# EasyEDA Pro project plotter-esp.epro

# Schematic Schematic1
Board Name: Board1; Create Date: 2026-03-18; Page Name: P1; Project Name: New Project_2026-03-18_12-49-19; Schematic Name: Schematic1; Update Date: 2026-03-18; Company: EasyEDA.com; Page Size: A4; Version: V1.0
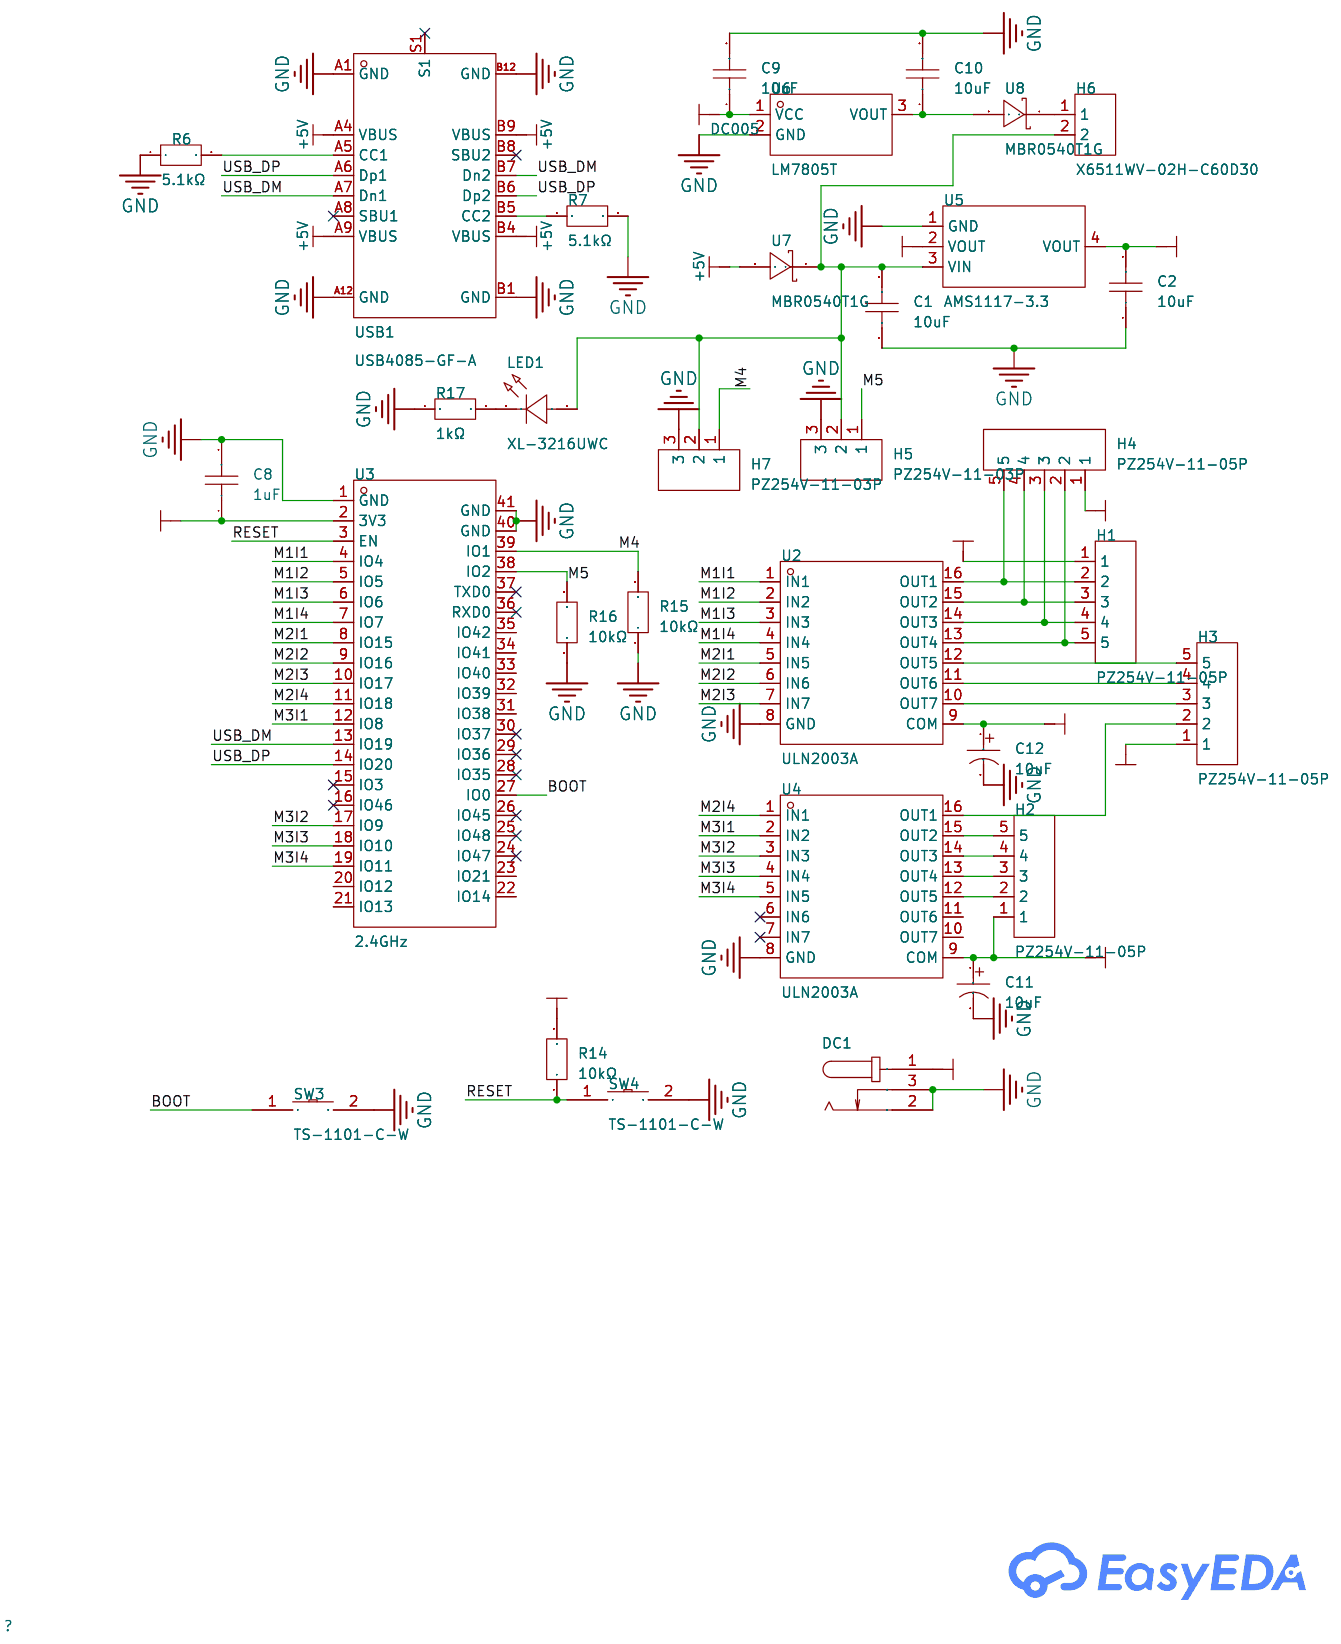
[diagram p0: schematic sheet]

## Parts
C1  10uF  [C1206]
C2  10uF  [C1206]
C8  1uF  [C1206]
C9  10uF  [C1206]
C10  10uF  [C1206]
C11  10uF  [CAP-TH_BD4.0-P1.50-D0.8-FD]
C12  10uF  [CAP-TH_BD4.0-P1.50-D0.8-FD]
DC1  DC005  [DC-IN-TH_DC005]
H1  PZ254V-11-05P  [HDR-TH_5P-P2.54-V-M]
H2  PZ254V-11-05P  [HDR-TH_5P-P2.54-V-M]
H3  PZ254V-11-05P  [HDR-TH_5P-P2.54-V-M]
H4  PZ254V-11-05P  [HDR-TH_5P-P2.54-V-M]
H5  PZ254V-11-03P  [HDR-TH_3P-P2.54-V-M_PZ254V-11-03P]
H6  X6511WV-02H-C60D30  [HDR-TH_2P-P2.54-V-M]
H7  PZ254V-11-03P  [HDR-TH_3P-P2.54-V-M_PZ254V-11-03P]
LED1  XL-3216UWC  [LED1206-R-RD_WHITE]
R6  5.1kΩ  [R1206]
R7  5.1kΩ  [R1206]
R14  10kΩ  [R1206]
R15  10kΩ  [R1206]
R16  10kΩ  [R1206]
R17  1kΩ  [R1206]
SW3  TS-1101-C-W  [SW-SMD_L6.0-W3.3-LS8.0]
SW4  TS-1101-C-W  [SW-SMD_L6.0-W3.3-LS8.0]
U2  ULN2003A  [DIP-16_L20.0-W6.4-P2.54-LS7.6-BL]
U3  2.4GHz  [WIRELM-SMD_ESP32-S3-WROOM-1U]
U4  ULN2003A  [DIP-16_L20.0-W6.4-P2.54-LS7.6-BL]
U5  AMS1117-3.3  [SOT-223-3_L6.5-W3.4-P2.30-LS7.0-BR]
U6  LM7805T  [TO-220-3_L10.1-W4.7-P2.54-L]
U7  MBR0540T1G  [SOD-123_L2.8-W1.8-LS3.7-RD]
U8  MBR0540T1G  [SOD-123_L2.8-W1.8-LS3.7-RD]
USB1  USB4085-GF-A  [USC-C-SMD_USB4085-GF-A]

## Library data of the parts
C1 C2 C9 C10 = CL31A106KAHNNNE: Capacitance:10uF Tolerance:±10% Tolerance:±10% Voltage Rating:25V Temperature Coefficient:X5R; LCSC Part Name: 10uF ±10% 25V; Supplier Part: C9807; Manufacturer: SAMSUNG(三星); Supplier Footprint: 1206; JLCPCB Part Class: Extended Part; Datasheet: https://item.szlcsc.com/datasheet/CL31A106KAHNNNE/10337.html; Supplier: LCSC; Tolerance: ±10%; Voltage Rating: 25V; Temperature Coefficient: X5R
C8 = CL31B105KBHNNNE: Capacitance:1uF Tolerance:±10% Tolerance:±10% Voltage Rating:50V Temperature Coefficient:X7R; LCSC Part Name: 1uF ±10% 50V; Supplier Part: C1848; Manufacturer: SAMSUNG(三星); Supplier Footprint: 1206; JLCPCB Part Class: Basic Part; Datasheet: https://item.szlcsc.com/datasheet/CL31B105KBHNNNE/2200.html; Supplier: LCSC; Tolerance: ±10%; Voltage Rating: 50V; Temperature Coefficient: X7R
C11 C12 = KF106M025C05RR0VH2FP0: Capacitance:10uF Tolerance:±20% Tolerance:±20% Voltage Rating:25V Ripple Current:20mA@120Hz Equivalent Series Resistance(ESR):- Pin Spacing:1.5mm Diameter:4mm Height - Seated (Max):5mm Lifetime:1000hrs@105℃ Operating Temperature:-40℃~+105℃ Operating Tempe; LCSC Part Name: 10uF ±20% 25V; Supplier Part: C43846; Manufacturer: Chengx(承兴); Supplier Footprint: 插件,D4xL5mm; JLCPCB Part Class: Extended Part; Datasheet: https://item.szlcsc.com/datasheet/KF106M025C05RR0VH2FP0/44848.html; Supplier: LCSC; Tolerance: ±20%; Voltage Rating: 25V; Ripple Current: 20mA@120Hz; Pin Spacing: 1.5mm; Diameter: 4mm; Height - Seated (Max): 5mm; Lifetime: 1000hrs@105℃; Operating Temperature: -40℃~+105℃
DC1 = DC005: Connector Type:DC Power Jack Mounting Type:Right Angle Inside Contact Diameter:2mm Outside Contact Diameter:6.3mm Current Rating:500mA Voltage Rating (Max):12V Operating Temperature:-30℃~+70℃ Operating Temperature:-30℃~+70℃; LCSC Part Name: DC005-2.0 黑（铁）; Supplier Part: C431533; Manufacturer: SHOU HAN(首韩); Supplier Footprint: 插件; JLCPCB Part Class: Extended Part; Datasheet: https://item.szlcsc.com/datasheet/DC005/427890.html; Supplier: LCSC; Connector Type: DC Power Jack; Mounting Type: Right Angle; Inside Contact Diameter: 2mm; Outside Contact Diameter: 6.3mm; Current Rating: 500mA; Voltage Rating (Max): 12V; Operating Temperature: -30℃~+70℃
H1-H4 = PZ254V-11-05P: Pin Structure:1x5P Pitch:2.54mm Row Spacing:- Circluar Pins/Square Pins:Pin Header Mounting Type:Through Hole Number of Rows:1 Number of Pins:5P Current Rating:3A Voltage Rating (Max):250V Length of Mating Pin:6mm Insulation Height:2.5mm Length of End Con; LCSC Part Name: 1x5P 间距:2.54mm 方针 直插; Supplier Part: C492404; Manufacturer: XFCN(兴飞); Supplier Footprint: 插件,P=2.54mm; JLCPCB Part Class: Extended Part; Datasheet: https://item.szlcsc.com/datasheet/PZ254V-11-05P/502960.html; Supplier: LCSC; Pin Structure: 1x5P; Pitch: 2.54mm; Circluar Pins/Square Pins: Pin Header; Mounting Type: Through Hole; Number of Rows: 1; Number of Pins: 5P; Current Rating: 3A; Voltage Rating (Max): 250V; Length of Mating Pin: 6mm; Insulation Height: 2.5mm; Length of End Connection Pin: 3mm; Contact Material: Brass; Operating Temperature: -40℃~+105℃; Color: Black
H5 H7 = PZ254V-11-03P: Pin Structure:1x3P Pitch:2.54mm Row Spacing:- Circluar Pins/Square Pins:Pin Header Mounting Type:Through Hole Number of Rows:1 Number of Pins:3P Current Rating:3A Voltage Rating (Max):250V Length of Mating Pin:6mm Insulation Height:2.5mm Length of End Con; LCSC Part Name: 1x3P 间距:2.54mm 方针 直插; Supplier Part: C2937625; Manufacturer: XFCN(兴飞); Supplier Footprint: 插件,P=2.54mm; JLCPCB Part Class: Extended Part; Datasheet: https://item.szlcsc.com/datasheet/PZ254V-11-03P/3293280.html; Supplier: LCSC; Pin Structure: 1x3P; Pitch: 2.54mm; Circluar Pins/Square Pins: Pin Header; Mounting Type: Through Hole; Number of Rows: 1; Number of Pins: 3P; Current Rating: 3A; Voltage Rating (Max): 250V; Length of Mating Pin: 6mm; Insulation Height: 2.5mm; Length of End Connection Pin: 3mm; Operating Temperature: -40℃~+105℃; Color: Black
H6 = X6511WV-02H-C60D30: Pin Structure:1x2P Pitch:2.54mm Row Spacing:2.54mm Circluar Pins/Square Pins:Pin Header Number of Rows:1 Number of Pins:2P Current Rating:3A Voltage Rating (Max):250V Length of Mating Pin:- Insulation Height:2.5mm Length of End Connection Pin:- Contact Ma; LCSC Part Name: 1x2P 间距:2.54mm 方针; Supplier Part: C706874; Manufacturer: XKB Connection(中国星坤); Supplier Footprint: 插件,P=2.54mm; JLCPCB Part Class: Extended Part; Datasheet: https://item.szlcsc.com/datasheet/X6511WV-02H-C60D30/743996.html; Supplier: LCSC; Pin Structure: 1x2P; Pitch: 2.54mm; Row Spacing: 2.54mm; Circluar Pins/Square Pins: Pin Header; Number of Rows: 1; Number of Pins: 2P; Current Rating: 3A; Voltage Rating (Max): 250V; Insulation Height: 2.5mm; Contact Material: Brass; Contact Plating: Gold; Operating Temperature: -40℃~+105℃; Color: Black
LED1 = XL-3216UWC: Lamp Holder Type:- Illumination Color:White Voltage - Forward(Vf):3.4V Voltage - Forward(Vf):3.4V Power(Watts):70mW Forward Current:20mA Wavelength - Dominant:- Wavelength - Dominant:- Peak Wavelength:- Diode Configuration:- Lens Color:Yellow Lens Color T; LCSC Part Name: 1206白光贴片式发光二极管; Supplier Part: C965828; Manufacturer: XINGLIGHT(成兴光); Supplier Footprint: 1206; JLCPCB Part Class: Extended Part; Datasheet: https://item.szlcsc.com/datasheet/XL-3216UWC/1051437.html; Supplier: LCSC; Illumination Color: White; Voltage - Forward(Vf): 3.4V; Power(Watts): 70mW; Forward Current: 20mA; Lens Color: Yellow Lens; Color Temperature: 12000K~27000K; Luminous Intensity: 1300mcd; Viewing Angle: 120°; Mounting Style: op View Mount; Operating Temperature: -40℃~+85℃
R6 R7 = FRC1206J512 TS: Type:Thick Film Resistor Resistance:5.1kΩ Tolerance:±5% Tolerance:±5% Power(Watts):250mW Voltage-Supply(Max):200V Temperature Coefficient:±100ppm/℃ Temperature Coefficient:±100ppm/℃ Operating Temperature:-55℃~+155℃ Operating Temperature:-55℃~+155℃; LCSC Part Name: 5.1kΩ ±5% 250mW 厚膜电阻; Supplier Part: C2907509; Manufacturer: FOJAN(富捷); Supplier Footprint: 1206; JLCPCB Part Class: Extended Part; Supplier: LCSC; Type: Thick Film Resistor; Tolerance: ±5%; Power(Watts): 250mW; Voltage-Supply(Max): 200V; Temperature Coefficient: ±100ppm/℃; Operating Temperature: -55℃~+155℃
R14-R16 = FRC1206J103 TS: Type:Thick Film Resistor Resistance:10kΩ Tolerance:±5% Tolerance:±5% Power(Watts):250mW Voltage-Supply(Max):200V Temperature Coefficient:±100ppm/℃ Temperature Coefficient:±100ppm/℃ Operating Temperature:-55℃~+155℃ Operating Temperature:-55℃~+155℃; LCSC Part Name: 10kΩ ±5% 250mW 厚膜电阻; Supplier Part: C2907423; Manufacturer: FOJAN(富捷); Supplier Footprint: 1206; JLCPCB Part Class: Extended Part; Supplier: LCSC; Type: Thick Film Resistor; Tolerance: ±5%; Power(Watts): 250mW; Voltage-Supply(Max): 200V; Temperature Coefficient: ±100ppm/℃; Operating Temperature: -55℃~+155℃
R17 = FRC1206J102 TS: Type:Thick Film Resistor Resistance:1kΩ Tolerance:±5% Tolerance:±5% Power(Watts):250mW Voltage-Supply(Max):200V Temperature Coefficient:±100ppm/℃ Temperature Coefficient:±100ppm/℃ Operating Temperature:-55℃~+155℃ Operating Temperature:-55℃~+155℃; LCSC Part Name: 1kΩ ±5% 250mW 厚膜电阻; Supplier Part: C2907440; Manufacturer: FOJAN(富捷); Supplier Footprint: 1206; JLCPCB Part Class: Extended Part; Supplier: LCSC; Type: Thick Film Resistor; Tolerance: ±5%; Power(Watts): 250mW; Voltage-Supply(Max): 200V; Temperature Coefficient: ±100ppm/℃; Operating Temperature: -55℃~+155℃
SW3 SW4 = TS-1101-C-W: Circuit:SPST Actuator Style:Rectangle button Operating Force:260gf Mounting Style:Brick nogging Switch Length:6mm Switch Width:3.6mm Switch Height:2.5mm Strike Gundam:不带 Contact Current:50mA Voltage Rating (AC):- Voltage Rating (DC):12V Power Rating:- Ins; LCSC Part Name: 6*3.6*2.5mm 立贴 轻触开关; Supplier Part: C318938; Manufacturer: XKB Connectivity(中国星坤); Supplier Footprint: SMD; JLCPCB Part Class: Extended Part; Datasheet: https://atta.szlcsc.com/upload/public/pdf/source/20200227/C318938_C2E53B1EEDE37D980A33616AC086DE53.pdf; Supplier: LCSC; Circuit: SPST; Actuator Style: Rectangle button; Operating Force: 260gf; Mounting Style: Brick nogging; Switch Length: 6mm; Switch Width: 3.6mm; Switch Height: 2.5mm; Strike Gundam: 不带; Contact Current: 50mA; Voltage Rating (DC): 12V; Actuator/Cap Color: 白色带淡绿; With Lamp: No; Mechanical Life: 5万次; Operating Temperature: -30℃~+85℃
U2 U4 = ULN2003A_C93000: number of channels:7 Collector - Emitter Voltage VCEO:50V Current - Collector(Ic):500mA Voltage - Input(Max):30V Operating Temperature:-40℃~+85℃ Operating Temperature:-40℃~+85℃ Output Leakage Current(Icex):50uA Input Current(on):0.82mA Input Current(off):; LCSC Part Name: 七达林顿阵列; Supplier Part: C93000; Manufacturer: ST(意法半导体); Supplier Footprint: DIP-16; JLCPCB Part Class: Extended Part; Datasheet: https://item.szlcsc.com/datasheet/ULN2003A/94195.html; Supplier: LCSC; number of channels: 7; Collector - Emitter Voltage VCEO: 50V; Current - Collector(Ic): 500mA; Voltage - Input(Max): 30V; Operating Temperature: -40℃~+85℃; Output Leakage Current(Icex): 50uA; Input Current(on): 0.82mA; Input Current(off): 65uA; Voltage - Forward(Vf): 1.7V; Input Capacitiance(Ci): 15pF
U3 = ESP32-S3-WROOM-1U-N4R8: Utilized IC / Part:ESP32-S3R8 Wireless Standard:Bluetooth5.0 Interface Type:I2C；GPIO；UART；SPI；SDIO；USB；I2S Frequency:2.4GHz Output Power:20.5dBm Output Power:20.5dBm Voltage - Supply:3V~3.6V Voltage - Supply:3V~3.6V Receive  Current:95mA Send  Current:355; LCSC Part Name: 不带固件 通用型Wi-Fi+低功耗蓝牙MCU模组; Supplier Part: C3013943; Manufacturer: ESPRESSIF(乐鑫); Supplier Footprint: SMD,19.2x18mm; JLCPCB Part Class: Extended Part; Datasheet: https://item.szlcsc.com/datasheet/ESP32-S3-WROOM-1U-N4R8/3522413.html; Supplier: LCSC; Utilized IC / Part: ESP32-S3R8; Wireless Standard: Bluetooth5.0; Interface Type: I2C；GPIO；UART；SPI；SDIO；USB；I2S; Output Power: 20.5dBm; Voltage - Supply: 3V~3.6V; Receive  Current: 95mA; Send  Current: 355mA; Sensitivity: -103.5dBm; Operating Temperature: -40℃~+65℃
U5 = AMS1117-3.3_C6186: Output Type:Fixed Voltage - Supply:15V Output Voltage:3.3V Output Voltage:3.3V Output Current:1A Power Supply Rejection Ratio (PSRR):72dB@(120Hz) Voltage Dropout:1.1V@(800mA) standby current:5mA Noise:0.003%Vout Features:Over Current Protection；Thermal Sh; LCSC Part Name: 3.3V 1A 15V; Supplier Part: C6186; Manufacturer: AMS; Supplier Footprint: SOT-223; JLCPCB Part Class: Basic Part; Datasheet: https://item.szlcsc.com/datasheet/AMS1117-3.3/6652.html; Supplier: LCSC; Output Type: Fixed; Voltage - Supply: 15V; Output Voltage: 3.3V; Output Current: 1A; Power Supply Rejection Ratio (PSRR): 72dB@(120Hz); Voltage Dropout: 1.1V@(800mA); standby current: 5mA; Noise: 0.003%Vout; Features: Over Current Protection；Thermal Shutdown; Operating Temperature: -40℃~+125℃; Output Configuration: Positive; Number of Outputs: 1
U6 = LM7805T_C7432180: Supplier Part: C7432180; Manufacturer: HGSEMI(华冠); Supplier Footprint: TO-220-3; JLCPCB Part Class: Extended Part; Datasheet: https://atta.szlcsc.com/upload/public/pdf/source/20240307/E28367F2CC2BC825DF756EF02CE1AF99.pdf; Supplier: LCSC
U7 U8 = MBR0540T1G_C20611940: Diode Configuration:Independent Voltage - Forward(Vf@If):550mV@500mA Voltage - DC Reverse(Vr):40V Current - Rectified:500mA Reverse Leakage Current (Ir):- Operating Junction Temperature Range:-40℃~+125℃ Operating Junction Temperature Range:-40℃~+125℃ Non-; LCSC Part Name: 电压:40V 电流:0.5A; Supplier Part: C20611940; Manufacturer: HXY MOSFET(华轩阳电子); Supplier Footprint: SOD-123; JLCPCB Part Class: Extended Part; Datasheet: https://item.szlcsc.com/datasheet/MBR0540T1G/21968540.html; Supplier: LCSC; Diode Configuration: Independent; Voltage - Forward(Vf@If): 550mV@500mA; Voltage - DC Reverse(Vr): 40V; Current - Rectified: 500mA; Operating Junction Temperature Range: -40℃~+125℃; Non-Repetitive Peak Forward Surge Current: 5.5A
USB1 = USB4085-GF-A_C7095263: Connector Type:Type-C Protocol Standard:USB 2.0 Gender:Female Mounting Type:Right Angle Number of Ports:1 Current Rating-Power:5A Voltage Rating:48V Detection color:Black Operating Temperature:-40℃~+85℃ Operating Temperature:-40℃~+85℃; LCSC Part Name: Type-C 母 弯插; Supplier Part: C7095263; Manufacturer: GCT; Supplier Footprint: 插件; JLCPCB Part Class: Extended Part; Datasheet: https://item.szlcsc.com/datasheet/USB4085-GF-A/8061907.html; Supplier: LCSC; Connector Type: Type-C; Protocol Standard: USB 2.0; Gender: Female; Mounting Type: Right Angle; Number of Ports: 1; Current Rating-Power: 5A; Voltage Rating: 48V; Detection color: Black; Operating Temperature: -40℃~+85℃

## Nets
+3V3: C2.2 C8.1 R14.2 U3.2(3V3) U5.2(VOUT) U5.4(VOUT)
+5V: U7.2(A) USB1.A4(VBUS) USB1.A9(VBUS) USB1.B4(VBUS) USB1.B9(VBUS)
+12V: C9.1 C11.1 C12.1 DC1.1 H1.1 H2.1 H3.1 H4.1 U2.9(COM) U4.9(COM) U6.1(VCC)
GND: C1.1 C2.1 C8.2 C9.2 C10.2 C11.2 C12.2 DC1.2 DC1.3 H5.3 H7.3 R6.1 R7.2 R15.1 R16.1 R17.1 SW3.2 SW4.2 U2.8(GND) U3.1(GND) U3.40(GND) U3.41(GND) U4.8(GND) U5.1(GND) U6.2(GND) USB1.A1(GND) USB1.A12(GND) USB1.B1(GND) USB1.B12(GND)
BOOT: SW3.1 U3.27(IO0)
M1I1: U2.1(IN1) U3.4(IO4)
M1I2: U2.2(IN2) U3.5(IO5)
M1I3: U2.3(IN3) U3.6(IO6)
M1I4: U2.4(IN4) U3.7(IO7)
M2I1: U2.5(IN5) U3.8(IO15)
M2I2: U2.6(IN6) U3.9(IO16)
M2I3: U2.7(IN7) U3.10(IO17)
M2I4: U3.11(IO18) U4.1(IN1)
M3I1: U3.12(IO8) U4.2(IN2)
M3I2: U3.17(IO9) U4.3(IN3)
M3I3: U3.18(IO10) U4.4(IN4)
M3I4: U3.19(IO11) U4.5(IN5)
M4: H7.1 R15.2 U3.39(IO1)
M5: H5.1 R16.2 U3.38(IO2)
RESET: R14.1 SW4.1 U3.3(EN)
USB_DM: U3.13(IO19) USB1.A7(Dn1) USB1.B7(Dn2)
USB_DP: U3.14(IO20) USB1.A6(Dp1) USB1.B6(Dp2)
$1N1367: R6.2 USB1.A5(CC1)
$1N1368: R7.1 USB1.B5(CC2)
$1N2084: C1.2 H5.2 H6.2 H7.2 LED1.1(A) U5.3(VIN) U7.1(K)
$1N2607: H1.5 H4.2 U2.13(OUT4)
$1N2609: H1.4 H4.3 U2.14(OUT3)
$1N2611: H1.3 H4.4 U2.15(OUT2)
$1N2613: H1.2 H4.5 U2.16(OUT1)
$1N2698: H2.5 U4.15(OUT2)
$1N2702: H2.4 U4.14(OUT3)
$1N2706: H2.3 U4.13(OUT4)
$1N2710: H2.2 U4.12(OUT5)
$1N2808: H3.5 U2.12(OUT5)
$1N2812: H3.4 U2.11(OUT6)
$1N2819: H3.3 U2.10(OUT7)
$1N2823: H3.2 U4.16(OUT1)
$1N3418: C10.1 U6.3(VOUT) U8.2(A)
$1N4082: H6.1 U8.1(K)
$1N4561: LED1.2(K) R17.2

Not connected (* = marked no-connect by the designer): U3 15(IO3)* 16(IO46)* 20(IO12) 21(IO13) 22(IO14) 23(IO21) 24(IO47)* 25(IO48)* 26(IO45)* 28(IO35)* 29(IO36)* 30(IO37)* 31(IO38) 32(IO39) 33(IO40) 34(IO41) 35(IO42) 36(RXD0)* 37(TXD0)*; U4 6(IN6)* 7(IN7)* 10(OUT7) 11(OUT6); USB1 A8(SBU1)* B8(SBU2)* S1*

# Board PCB1
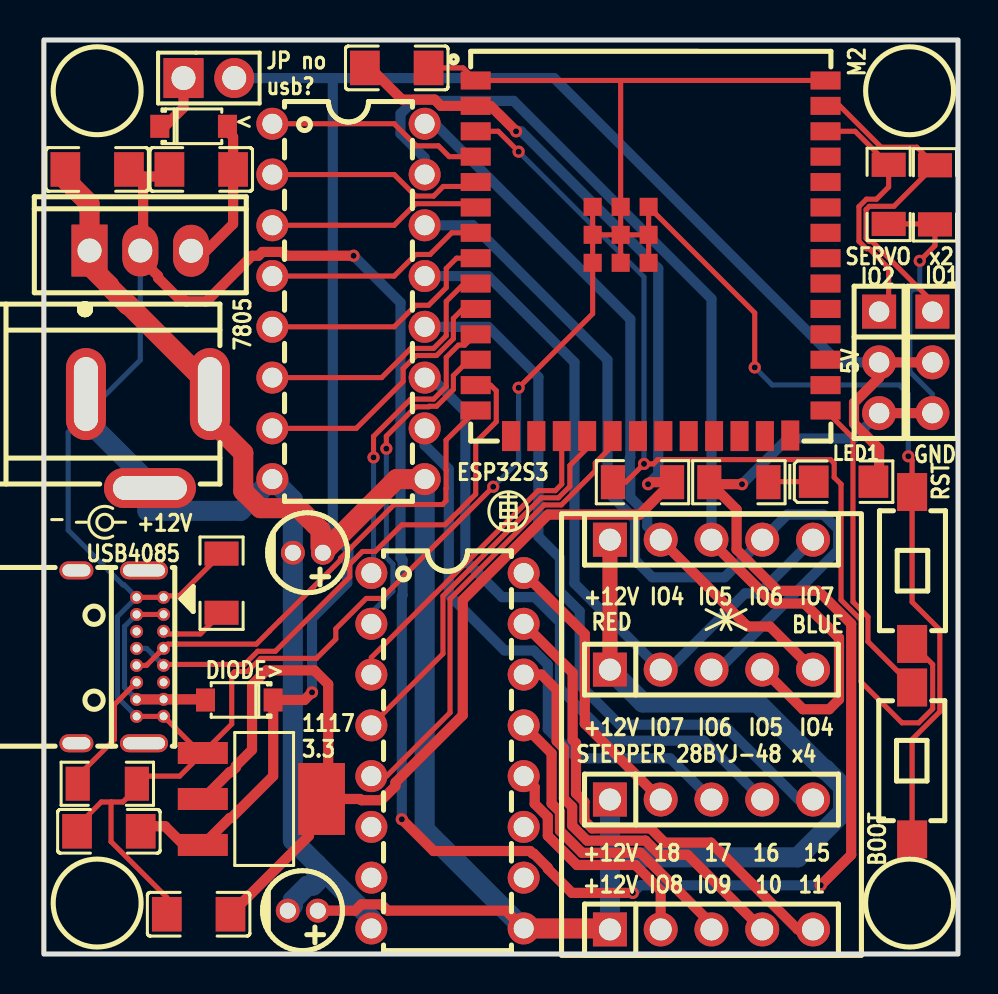
[diagram p1: board, top side]
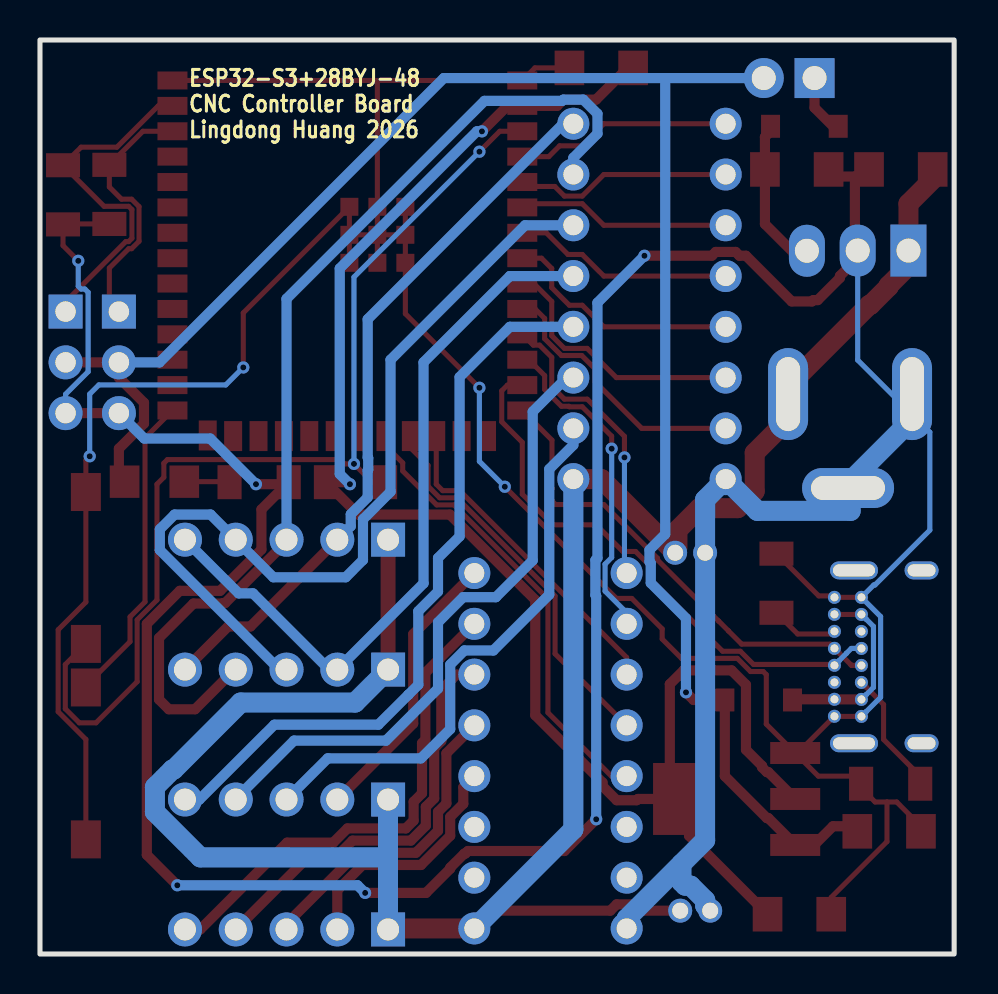
[diagram p2: board, bottom side, seen from below]

Outline 45.73 x 45.73 mm; copper layers: Top Layer, Bottom Layer. Coordinates in mm from the lower left corner of the outline.
Outline path: rectangle 0,45.73 45.73,0
Stack: Top Layer 0.035mm / Dielectric1 1.51mm FR4 er 4.5 / Bottom Layer 0.035mm

## Design rules (mm)
template: JLCPCB Capability(Two Layers Board)
spacing copperThickness1oz (default): track to track 0.102, other pairs 0.152 to 0.3
spacing copperThickness2oz: track to track 0.203, other pairs 0.152 to 0.3
track width copperThickness1oz (default): min 0.127, default 0.254, max 2.54
track width copperThickness2oz: min 0.203, default 0.254, max 2.54
differential pair differentialPair (default): width min 0.127, default 0.254, max 2.54; gap min 0.152, default 0.152
via viaSize (default): diameter min 0.5, default 0.61, max 10; hole min 0.3, default 0.305, max 6.3

## Placement (name value [footprint] x y rotation side)
C1  10uF  [C1206]  3.25 6.14 0 top
C2  10uF  [C1206]  7.74 1.99 0 top
C8  1uF  [C1206]  17.65 44.33 0 top
C9  10uF  [C1206]  2.67 39.25 0 top
C10  10uF  [C1206]  7.87 39.25 180 top
C11  10uF  [CAP-TH_BD4.0-P1.50-D0.8-FD]  12.95 2.17 180 top
C12  10uF  [CAP-TH_BD4.0-P1.50-D0.8-FD]  13.21 20.08 180 top
DC1  DC005  [DC-IN-TH_DC005]  5.21 25.66 0 top
H1  PZ254V-11-05P  [HDR-TH_5P-P2.54-V-M]  33.4 20.73 0 top
H2  PZ254V-11-05P  [HDR-TH_5P-P2.54-V-M]  33.4 1.23 0 top
H3  PZ254V-11-05P  [HDR-TH_5P-P2.54-V-M]  33.4 7.73 0 top
H4  PZ254V-11-05P  [HDR-TH_5P-P2.54-V-M]  33.4 14.23 0 top
H5  PZ254V-11-03P  [HDR-TH_3P-P2.54-V-M_PZ254V-11-03P]  41.78 29.6 270 top
H6  X6511WV-02H-C60D30  [HDR-TH_2P-P2.54-V-M]  8.25 43.83 0 top
H7  PZ254V-11-03P  [HDR-TH_3P-P2.54-V-M_PZ254V-11-03P]  44.45 29.6 270 top
LED1  XL-3216UWC  [LED1206-R-RD_WHITE]  40 23.63 0 top
R6  5.1kΩ  [R1206]  8.89 18.55 270 top
R7  5.1kΩ  [R1206]  3.18 8.52 0 top
R14  10kΩ  [R1206]  29.95 23.61 0 top
R15  10kΩ  [R1206]  44.58 37.98 90 top
R16  10kΩ  [R1206]  42.26 38 90 top
R17  1kΩ  [R1206]  34.77 23.61 0 top
SW3  TS-1101-C-W  [SW-SMD_L6.0-W3.3-LS8.0]  43.43 9.54 270 top
SW4  TS-1101-C-W  [SW-SMD_L6.0-W3.3-LS8.0]  43.43 19.31 90 top
U2  ULN2003A  [DIP-16_L20.0-W6.4-P2.54-LS7.6-BL]  15.24 32.65 270 top
U3  2.4GHz  [WIRELM-SMD_ESP32-S3-WROOM-1U]  30.35 34.81 0 top
U4  ULN2003A  [DIP-16_L20.0-W6.4-P2.54-LS7.6-BL]  20.19 10.17 270 top
U5  AMS1117-3.3  [SOT-223-3_L6.5-W3.4-P2.30-LS7.0-BR]  10.92 7.76 180 top
U6  LM7805T  [TO-220-3_L10.1-W4.7-P2.54-L]  4.83 35.19 0 top
U7  MBR0540T1G  [SOD-123_L2.8-W1.8-LS3.7-RD]  9.78 12.71 180 top
U8  MBR0540T1G  [SOD-123_L2.8-W1.8-LS3.7-RD]  7.49 41.41 0 top
USB1  USB4085-GF-A  [USC-C-SMD_USB4085-GF-A]  3.81 14.87 270 top

## Footprints (pads in the part's own frame, mm; a bottom-side part is the same pattern mirrored in y, then rotated)
C1206
  rect 1.485x1.728 smd: 1(-1.593,0) 2(1.593,0)
CAP-TH_BD4.0-P1.50-D0.8-FD
  round 1.2 hole 0.8: 1(-0.75,0) 2(0.75,0)
DC-IN-TH_DC005
  oval 2x4.6 hole 1.2x3.7: 1(3.1,2.35) 2(-3.1,2.35)
  oval 4.6x2 hole 3.7x1.2: 3(0.1,-2.35)
DIP-16_L20.0-W6.4-P2.54-LS7.6-BL
  round 1.6 hole 1: 1(-8.89,-3.81) 2(-6.35,-3.81) 3(-3.81,-3.81) 4(-1.27,-3.81) 5(1.27,-3.81) 6(3.81,-3.81) 7(6.35,-3.81) 8(8.89,-3.81) 9(8.89,3.81) 10(6.35,3.81) 11(3.81,3.81) 12(1.27,3.81) 13(-1.27,3.81) 14(-3.81,3.81) 15(-6.35,3.81) 16(-8.89,3.81)
HDR-TH_2P-P2.54-V-M
  rect 2x2 hole 1.2: 1(-1.27,0)
  round 2 hole 1.2: 2(1.27,0)
HDR-TH_3P-P2.54-V-M_PZ254V-11-03P
  rect 1.7x1.7 hole 1.02: 1(-2.54,0)
  round 1.7 hole 1.02: 2(0,0) 3(2.54,0)
HDR-TH_5P-P2.54-V-M
  rect 1.7x1.7 hole 1.1: 1(-5.08,0)
  round 1.7 hole 1.1: 2(-2.54,0) 3(0,0) 4(2.54,0) 5(5.08,0)
LED1206-R-RD_WHITE
  rect 1.485x1.62 smd: 1(1.492,0) 2(-1.492,0)
R1206
  rect 1.208x1.701 smd: 1(-1.479,0) 2(1.479,0)
SOD-123_L2.8-W1.8-LS3.7-RD
  rect 0.95x1.15 smd: 1(-1.692,0) 2(1.692,0)
SOT-223-3_L6.5-W3.4-P2.30-LS7.0-BR
  rect 2.5x1.1 smd: 1(2.97,-2.3) 2(2.97,0) 3(2.97,2.3)
  rect 2.34x3.6 smd: 4(-2.97,0)
SW-SMD_L6.0-W3.3-LS8.0
  rect 1.9x1.5 smd: 1(-3.8,0) 2(3.8,0)
TO-220-3_L10.1-W4.7-P2.54-L
  rect 1.8x2.6 hole 1.2: 1(-2.54,0.005)
  oval 1.8x2.6 hole 1.2: 2(0,0.005) 3(2.54,-0.005)
USC-C-SMD_USB4085-GF-A
  round 0.65 hole 0.4: A1(-2.975,2.18) A4(-2.125,2.18) A5(-1.275,2.18) A6(-0.425,2.18) A7(0.425,2.18) A8(1.275,2.18) A9(2.125,2.18) A12(2.975,2.18) B1(2.98,0.83) B4(2.13,0.83) B5(1.28,0.83) B6(0.43,0.83) B7(-0.42,0.83) B8(-1.27,0.83) B9(-2.12,0.83) B12(-2.975,0.83)
  oval 0.9x2.4 hole 0.6x2.1: S1(-4.325,1.2) S1(4.325,1.2)
  oval 0.9x1.7 hole 0.6x1.4: S1(-4.325,-2.18) S1(4.325,-2.18)
WIRELM-SMD_ESP32-S3-WROOM-1U
  rect 1.5x0.9 smd: 1(-8.75,8.895) 2(-8.75,7.625) 3(-8.75,6.355) 4(-8.75,5.085) 5(-8.75,3.815) 6(-8.75,2.545) 7(-8.75,1.275) 8(-8.75,0.005) 9(-8.75,-1.265) 10(-8.75,-2.535) 11(-8.75,-3.805) 12(-8.75,-5.075) 13(-8.75,-6.345) 14(-8.75,-7.615) 27(8.75,-7.615) 28(8.75,-6.345) 29(8.75,-5.075) 30(8.75,-3.805) 31(8.75,-2.535) 32(8.75,-1.265) 33(8.75,0.005) 34(8.75,1.275) 35(8.75,2.545) 36(8.75,3.815) 37(8.75,5.085) 38(8.75,6.355) 39(8.75,7.625) 40(8.75,8.895)
  rect 0.9x1.5 smd: 15(-6.985,-8.895) 16(-5.715,-8.895) 17(-4.445,-8.895) 18(-3.175,-8.895) 19(-1.905,-8.895) 20(-0.635,-8.895) 21(0.635,-8.895) 22(1.905,-8.895) 23(3.175,-8.895) 24(4.445,-8.895) 25(5.715,-8.895) 26(6.985,-8.865)
  rect 0.9x0.9 smd: 41(-2.9,2.575) 41(-2.9,1.175) 41(-2.9,-0.225) 41(-1.5,2.575) 41(-1.5,1.175) 41(-1.5,-0.225) 41(-0.1,2.575) 41(-0.1,1.175) 41(-0.1,-0.225)

## Nets
As in the schematic.

Pads without a net: U3 15 16 20 21 22 23 24 25 26 28 29 30 31 32 33 34 35 36 37; U4 6 7 10 11; USB1 A8 B8 S1

## Via types
v1: diameter 0.61, hole 0.305, Top Layer to Bottom Layer, 17 vias

## Routing (per net, layer and track width the routed paths; a pad name or vN(x,y) marks a point on that pad's centre or on a via; arc(x,y) is an arc through that point)
+3V3: length 83.4
  Top Layer w0.254: 16.33,44.33 C8.1 ; 13.26,7.13 U5.4 ; 22.35,42.43 U3.2 ; 30.98,23.16 R14.2
  Top Layer w0.508: 30.98,23.16 29.81,21.99 25.22,21.99 20.96,17.72 20.96,11.95 17.59,8.58 17.59,8.4 16.88,7.69 15.88,7.69 15.82,7.76 U5.4 14.22,8.09 14.22,13.5 13.53,14.19 11.13,14.19 10.41,13.47 10.41,10.22 9.61,9.41 9.61,9.34 9.37,9.1 9.3,9.1 U5.2 ; v1(30.23,23.51) 30.33,23.61 R14.2 ; v1(23.62,41.16) 22.35,42.43 ; 13.26,7.13 13.26,5.92 C2.2 ; 16.33,44.33 17.91,42.75 19.55,42.75 19.86,42.43 U3.2
  Bottom Layer w0.508: v1(30.23,23.51) 30.73,24.01 30.73,34.3 23.88,41.16 v1(23.62,41.16)
+5V: length 9.6
  Top Layer w0.254: USB1.B9 5.99,16.99 USB1.A4
  Top Layer w0.508: USB1.B4 5.99,12.74 USB1.A9 8.05,12.74 U7.2
  Bottom Layer w0.254: USB1.B4 4.39,12.98 4.39,12.98 4.04,13.34 4.04,16.39 4.39,16.74 4.39,16.74 USB1.B9
+12V: length 112.2
  Top Layer w0.508: U4.9 23.11,2.17 17.2,2.17 16.88,2.49 15.88,2.49 15.57,2.17 C11.1
  Top Layer w0.75: H1.1 H4.1
  Top Layer w1.001: C12.1 17.64,23.76 U2.9 ; H2.1 28.27,1.28 U4.9 ; 0.93,38.9 2.29,37.54 2.29,34.43 3.27,33.44 3.27,33.39 4.18,32.48 4.24,32.48 8.18,28.54 8.18,26.87 9.98,25.07 9.98,23.16 10.83,22.31 12.74,22.31 13.84,21.21 13.84,20.33
  Bottom Layer w1.001: U4.9 19.05,6.23 U2.9 ; H3.1 28.32,7.73 28.32,1.23 H2.1 ; H4.1 29.96,12.58 35.69,12.58 39.04,9.23 39.1,9.23 39.98,8.35 39.98,7.11 37.71,4.84 28.58,4.84
GND: length 327.2
  Top Layer w0.254: 3.36,7.61 2.87,7.61 1.66,6.39 ; 3.36,7.61 3.95,7.61 4.65,8.31 4.65,8.9 6.8,8.9 U5.1 ; 3.36,7.61 3.36,5.62 6.15,2.83 C2.1 ; U3.41 28.85,34.58 ; U3.41 U3.41 ; U3.41 U3.41 ; U3.41 U3.41 28.85,43.64 28.79,43.7 ; C8.2 20.97,44.33 U3.1 28.79,43.7 ; U3.41 27.45,32.04 v1(23.75,28.33) ; U3.41 U3.41 ; USB1.B12 USB1.A1 6.06,17.92 6.78,17.92 R6.1 ; v1(22.48,23.38) 16.89,17.79 16.13,17.79 14.61,16.27 14.61,15.76 13.64,14.79 10.84,14.79 10.19,14.13 9.55,14.13 9.4,13.98 9.4,11.5 U5.1 ; v1(35.56,29.35) 35.56,32.08 U3.41 U3.41 ; 28.79,43.7 U3.40 ; U5.1 7.83,10.06 USB1.A12 5.99,11.89 4.64,11.89 ; U3.41 30.25,34.58 ; v1(43.81,34.68) 44.58,35.44 R15.1 44.56,36.53 R16.1 ; v1(43.24,24.9) 43.43,24.71 SW4.2 43.43,17.61 44.82,16.22 44.82,12.12 43.43,10.74 43.43,5.73
  Top Layer w0.508: 6.28,38.87 6.26,38.9 4.97,38.9 ; 4.11,38.9 4.97,38.9 ; 4.97,38.9 4.97,34.57 4.83,34.43 5.21,34.43 5.72,33.92 5.72,33.83 6.83,32.72 7.05,32.72 7.11,32.65 8.13,32.65 10.41,34.94 10.74,34.94 10.93,35.12 11.93,35.12 12.12,34.94 v1(15.49,34.94) ; 41.78,27.06 44.45,27.06 ; v1(29.46,3.06) 26.42,3.06 25.21,4.27 25.21,4.32 24.5,5.03 24.45,5.03 24.32,5.15 19.49,5.15 v1(17.91,6.74) ; 33.39,23.51 v1(34.93,23.51) ; 33.39,23.51 34.65,22.24 34.65,20.24 36.72,18.17 38.74,18.17 40.39,16.52 40.39,4.96 v1(38.86,3.44) ; 33.39,23.51 R17.1
  Bottom Layer w0.254: 4.64,17.84 3.68,16.88 3.68,12.84 4.39,12.14 4.39,12.14 4.64,11.89 ; 4.83,34.43 4.83,29.72 1.22,26.11 1.22,21.2 3.96,18.47 4.02,18.47 USB1.B12 ; v1(23.75,28.33) 23.75,24.65 v1(22.48,23.38) ; v1(43.81,34.68) 43.81,33.41 43.67,33.27 43.48,33.27 43.32,33.11 43.32,29.13 44.45,28 44.45,27.06 ; v1(43.24,24.9) 43.24,28.01 42.78,28.47 36.44,28.47 v1(35.56,29.35)
  Bottom Layer w0.508: v1(34.93,23.51) 37.21,25.79 40.51,25.79 41.78,27.06 ; v1(29.46,3.06) 29.84,3.44 v1(38.86,3.44) ; v1(17.91,6.74) 17.91,17.92 17.95,17.95 17.95,19.71 17.84,19.81 17.84,32.59 v1(15.49,34.94)
  Bottom Layer w1.001: 1.98,26.87 5.18,23.67 5.18,22.17 9.84,22.17 U2.8 12.46,22.73 C12.2 12.46,5.69 13.64,4.51 ; 13.64,4.51 13.64,3.61 13.46,3.42 13.19,3.42 12.45,2.69 12.45,2.42 C11.2 ; 13.64,4.51 16.38,1.77 U4.8
BOOT: length 15.7
  Top Layer w0.254: U3.27 40.48,25.82 40.48,17.62 41.23,16.87 41.23,15.63 43.43,13.42 SW3.1
M1I1: length 10.9
  Top Layer w0.254: U2.1 17.52,41.54 18.63,40.43 19.74,40.43 20.28,39.89 U3.4
M1I2: length 10.9
  Top Layer w0.254: U2.2 17.52,39 18.6,37.92 19.5,37.92 19.98,38.4 21.38,38.4 U3.5
M1I3: length 10.7
  Top Layer w0.254: U2.3 17.52,36.46 18.6,37.54 21.42,37.54 U3.6
M1I4: length 11.1
  Top Layer w0.254: U2.4 17.52,33.92 18.6,35 19.32,35 20.4,36.08 21.6,36.08
M2I1: length 12.2
  Top Layer w0.254: U2.5 17.52,31.38 18.6,32.46 19.25,32.46 20.13,33.34 20.13,34.3 20.64,34.81 U3.8
M2I2: length 13.1
  Top Layer w0.254: U2.6 16.9,28.84 18.36,30.3 19.5,30.3 20.13,30.93 20.13,32.65 21.02,33.54 U3.9
M2I3: length 13.6
  Top Layer w0.254: U2.7 15.63,26.3 17.97,28.64 17.97,29.29 18.63,29.94 19.64,29.94 20.49,30.78 20.49,31.8 20.96,32.27 U3.10
M2I4: length 15
  Top Layer w0.254: U3.11 21.59,31 21.05,30.46 20.74,30.46 20.13,29.85 20.13,28.39 19.5,27.76 18.35,27.76 16.49,25.9 v1(16.49,24.85)
  Bottom Layer w0.254: U4.1 16.49,19.17 v1(16.49,24.85)
M3I1: length 16.4
  Top Layer w0.254: U3.12 21.34,29.47 21.02,29.47 20.49,28.94 20.49,28.24 19.64,27.4 19.27,27.4 19.25,27.38 18.6,27.38 17.13,25.91 v1(17.13,25.28)
  Bottom Layer w0.254: U4.2 16.38,17.08 17.46,18.16 17.46,19.51 17.13,19.84 v1(17.13,25.28)
M3I2: length 16.4
  Top Layer w0.254: U3.17 25.91,23.51 25.58,23.18 24.73,23.18 16.38,14.84 U4.3
M3I3: length 19.4
  Top Layer w0.254: U3.18 27.18,25.31 26.31,24.45 26.31,23.4 25.74,22.83 24.88,22.83 19.96,17.91 19.96,15.02 U4.4
M3I4: length 23
  Top Layer w0.254: U3.19 28.45,25.44 27.59,24.57 27.59,24.17 25.89,22.47 25.02,22.47 20.32,17.77 20.32,12.08 17.15,8.9 U4.5
M4: length 17.6
  Top Layer w0.254: H7.1 44.45,32.63 41.44,35.64 41.29,35.64 41.13,35.81 41.13,37.25 41.29,37.41 42.52,37.41 R15.2 43.67,40.37 41.88,40.37 39.81,42.43 U3.39
M5: length 13
  Top Layer w0.254: H5.1 42.26,32.62 42.26,34.32 41.29,35.29 41.15,35.29 40.78,35.66 40.78,37.39 41.15,37.76 41.65,37.76 42.26,38.38 R16.2 40.58,41.16 U3.38
RESET: length 52.3
  Top Layer w0.254: U3.3 22.73,41.16 v1(23.75,40.14) ; R14.1 29.11,23.61 v1(30.02,24.52) 30.49,24.52 30.71,24.74 39.36,24.74 39.53,24.56 39.53,23.85 39.88,23.51 39.88,17.71 40.87,16.72 40.87,13.62 42.93,11.57 43.76,11.57 44.46,12.27 44.46,14.48 SW4.1
  Bottom Layer w0.254: v1(23.75,40.14) 30.02,33.87 v1(30.02,24.52)
USB_DM: length 28
  Top Layer w0.254: USB1.A7 6.03,14.49 10.04,14.49 10.7,15.15 11.58,15.15 15.3,18.87 15.3,19.51 15.94,20.14 16.57,20.14 17.91,21.47 20.07,21.47 21.6,23.01 21.6,25.6 22.63,26.63 22.63,28.18 22.35,28.46 U3.13
  Bottom Layer w0.254: USB1.A7 5.74,14.69 5.74,14.69 5.39,15.04 5.39,15.05 5.15,15.29 USB1.B7
USB_DP: length 24.1
  Top Layer w0.254: USB1.B6 5.14,14.44 5.17,14.47 5.17,14.48 5.74,15.05 5.74,15.05 USB1.A6 6.2,15.5 10.63,15.5 11.29,16.16 11.29,16.17 11.78,16.66 11.79,16.66 14.84,19.71 14.84,19.8 17.53,22.49 19.94,22.49 20.12,22.67 20.12,23.3 20.13,23.31 20.13,24.21 20.12,24.22 20.12,25.71 U3.14
$1N1367: length 3.4
  Top Layer w0.254: USB1.A5 6.12,16.01 7.83,16.01 R6.2
$1N1368: length 5.9
  Top Layer w0.254: USB1.B5 4.39,13.34 4.39,13.34 3.53,12.48 3.53,10.73 1.7,8.9
$1N2084: length 94.1
  Top Layer w0.508: LED1.1 41.78,23.92 41.78,25.28 40.53,26.54 40.53,27.58 41.78,28.84 H5.2 H7.2 ; 4.85,6.39 6.06,6.39 7,5.46 U5.3 9.3,6.8 9.37,6.8 11.47,8.9 U7.1 13.03,12.71 v1(13.42,13.09)
  Bottom Layer w0.508: 14.45,43.83 14.45,21 15.24,20.22 15.24,19.62 15.18,19.56 15.18,18.56 13.42,16.8 v1(13.42,13.09) ; 14.45,43.83 25.53,43.83 39.75,29.6 H5.2 ; 14.45,43.83 H6.2
$1N2607: length 36.8
  Bottom Layer w0.508: U2.13 22.23,33.92 26.54,29.6 26.54,18.54 H4.2 31.26,14.23 35.07,18.04 35.79,18.04 H1.5
$1N2609: length 44.5
  Bottom Layer w0.508: H4.3 33.75,14.23 39.73,20.21 39.73,21.25 39,21.99 37.19,21.99 H1.4 34.06,18.85 30.44,18.85 29.57,19.71 29.57,21.75 28.19,23.13 28.19,29.73 21.46,36.46 U2.14
$1N2611: length 52
  Top Layer w0.508: H1.3 33.4,20.63 36.47,17.56 36.57,17.56 36.59,17.54 38.05,17.54 39.78,15.81 39.78,12.73 39.29,12.25 37.97,12.25 35.99,14.23 H4.4
  Bottom Layer w0.508: U2.15 19.05,39.83 17.84,41.04 17.84,42.04 18.55,42.75 19.55,42.75 19.61,42.68 23.5,42.68 33.4,32.78 H1.3
$1N2613: length 36.3
  Top Layer w0.508: H4.5 36.32,16.39 35.2,16.39 H1.2
  Bottom Layer w0.508: U2.16 19.56,41.54 29.34,31.76 29.34,24.84 29.31,24.82 29.31,24.23 29.34,24.2 29.34,22.85 30.18,22 30.18,21.4 H1.2
$1N2698: length 24.8
  Top Layer w0.508: H2.5 37.71,1.23 33.37,5.57 31.06,5.57 30.35,6.29 27.43,6.29 27.04,6.67 27.04,7.62 26.62,8.04 26.62,10.55 26.45,10.72 26.45,14.07 U4.15
$1N2702: length 20.7
  Top Layer w0.508: H2.4 32.2,4.96 30.81,4.96 30.1,5.67 27.18,5.67 26.43,6.42 26.43,7.37 26.01,7.78 26.01,10.3 25.65,10.65 25.65,13.22 24.89,13.98 U4.14
$1N2706: length 15.8
  Top Layer w0.508: H2.3 33.4,1.51 29.84,5.06 26.92,5.06 25.82,6.17 25.82,7.11 25.4,7.53 25.4,10.04 U4.13
$1N2710: length 12.2
  Top Layer w0.508: H2.2 30.86,3.19 29.59,4.45 26.67,4.45 25.21,5.92 25.21,6.86 24.55,7.51 24.55,8.35 U4.12
$1N2808: length 37
  Bottom Layer w0.508: U2.12 22.23,31.38 24.74,28.86 24.74,20.89 25.82,19.81 25.82,18.14 26.81,17.15 26.81,13.47 27.3,12.97 27.3,12.97 28.8,11.47 34.01,11.47 37.75,7.73 38.47,7.73 H3.5
$1N2812: length 31.9
  Bottom Layer w0.508: U2.11 19.38,28.84 21.08,27.13 21.08,19.7 22.92,17.85 24.56,17.85 25.82,16.59 25.82,13.28 28.42,10.68 33.02,10.68 35.94,7.76 H3.4
$1N2819: length 28.1
  Bottom Layer w0.508: U2.10 19.05,25.46 20.26,24.26 20.26,17.98 23.05,15.19 24.5,15.19 25.21,14.48 25.21,11.25 26.67,9.79 31.34,9.79 H3.3
$1N2823: length 14.2
  Top Layer w0.508: U4.16 27.06,16 27.06,11.53 H3.2
$1N3418: length 7.7
  Top Layer w0.508: 7.37,34.42 9.47,36.52 9.47,40.88 9.19,41.16
$1N4082: length 3.2
  Top Layer w0.508: H6.1 6.99,42.34 5.8,41.16
$1N4561: length 2.3
  Top Layer w0.254: LED1.2 36.27,23.63 R17.2

## Text on the board
Bottom Silkscreen Layer: ESP32-S3+28BYJ-48 / CNC Controller Board / Lingdong Huang 2026
Top Silkscreen Layer: 7805 | M2 | BOOT | RST | - | USB4085 | +12V | DIODE> | JP no / usb? | 1117 / 3.3 | ESP32S3 | STEPPER 28BYJ-48 x4 | RED | IO8 | IO7 | IO4 | 18 | IO9 | IO6 | IO5 | 17 | 16 | 10 | BLUE | 11 | 15 | SERVO | IO2 | GND | IO1 | x2 | 5V | >
